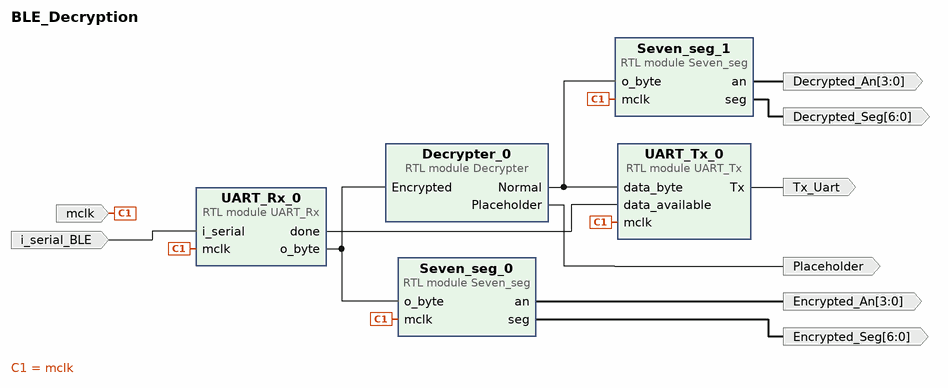
[diagram p0: block diagram of the top level]
# Vivado block design BLE_Decryption, xc7s50csga324-1, Vivado 2017.4
create_bd_design BLE_Decryption

create_bd_port -dir I mclk
create_bd_port -dir I i_serial_BLE
create_bd_port -dir O -from 3 -to 0 Encrypted_An
create_bd_port -dir O -from 6 -to 0 Encrypted_Seg
create_bd_port -dir O -from 3 -to 0 Decrypted_An
create_bd_port -dir O -from 6 -to 0 Decrypted_Seg
create_bd_port -dir O Tx_Uart
create_bd_port -dir O Placeholder

create_bd_cell -type module -reference UART_Rx UART_Rx_0
create_bd_cell -type module -reference Seven_seg Seven_seg_0
create_bd_cell -type module -reference Seven_seg Seven_seg_1
create_bd_cell -type module -reference UART_Tx UART_Tx_0
create_bd_cell -type module -reference Decrypter Decrypter_0

# ---- connections ----

connect_bd_net -net mclk_0_1 [get_bd_ports mclk] \
  [get_bd_pins UART_Rx_0/mclk] [get_bd_pins Seven_seg_0/mclk] [get_bd_pins Seven_seg_1/mclk] [get_bd_pins UART_Tx_0/mclk]
connect_bd_net -net i_serial_0_1 [get_bd_ports i_serial_BLE] [get_bd_pins UART_Rx_0/i_serial]
connect_bd_net [get_bd_pins UART_Rx_0/o_byte] [get_bd_pins Seven_seg_0/o_byte] [get_bd_pins Decrypter_0/Encrypted]
connect_bd_net [get_bd_pins Seven_seg_0/an] [get_bd_ports Encrypted_An]
connect_bd_net [get_bd_pins Seven_seg_0/seg] [get_bd_ports Encrypted_Seg]
connect_bd_net [get_bd_pins Decrypter_0/Normal] [get_bd_pins Seven_seg_1/o_byte] [get_bd_pins UART_Tx_0/data_byte]
connect_bd_net [get_bd_pins Seven_seg_1/an] [get_bd_ports Decrypted_An]
connect_bd_net [get_bd_pins Seven_seg_1/seg] [get_bd_ports Decrypted_Seg]
connect_bd_net [get_bd_pins UART_Rx_0/done] [get_bd_pins UART_Tx_0/data_available]
connect_bd_net [get_bd_pins Decrypter_0/Placeholder] [get_bd_ports Placeholder]
connect_bd_net [get_bd_pins UART_Tx_0/Tx] [get_bd_ports Tx_Uart]

validate_bd_design
save_bd_design
